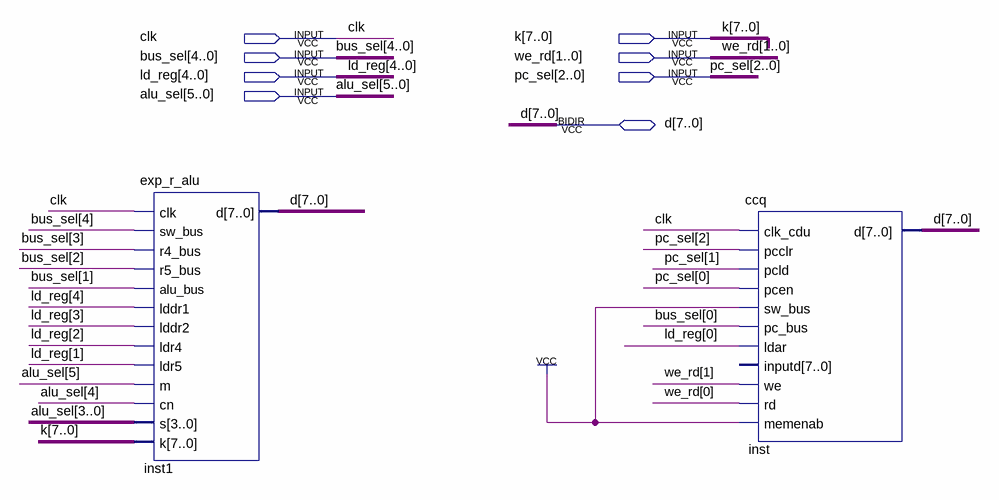
[diagram p0: schematic sheet]
// Quartus schematic sjtl2.bdf as structural Verilog: 2 symbols, 8 pins
module sjtl2 (
  input  clk,
  input  [7:0] k,
  input  [4:0] bus_sel,
  input  [1:0] we_rd,
  input  [4:0] ld_reg,
  input  [2:0] pc_sel,
  input  [5:0] alu_sel,
  inout  [7:0] d
);

  exp_r_alu inst1 (
    .clk(clk), .sw_bus(bus_sel[4]), .r4_bus(bus_sel[3]), .r5_bus(bus_sel[2]), .alu_bus(bus_sel[1]),
    .lddr1(ld_reg[4]), .lddr2(ld_reg[3]), .ldr4(ld_reg[2]), .ldr5(ld_reg[1]), .m(alu_sel[5]),
    .cn(alu_sel[4]), .s(alu_sel[3:0]), .k(k), .d(d));
  ccq inst (
    .clk_cdu(clk), .pcclr(pc_sel[2]), .pcld(pc_sel[1]), .pcen(pc_sel[0]), .sw_bus(1'b1), .pc_bus(bus_sel[0]),
    .ldar(ld_reg[0]), .we(we_rd[1]), .rd(we_rd[0]), .memenab(1'b1), .d(d));  // open: inputd
endmodule
